# Altium schematic sheet MeteoStation_MCU.SchDoc: Модуль метеостанции
size 594 x 420 mm; DrawnBy: Подлесный; DocumentNumber: ФНКЦ.452312.001 Э3; SheetNumber: 1; SheetTotal: 2; Format: A2; DocumentType: Электрическая принципиальная; ImagePath: Введите номер платы
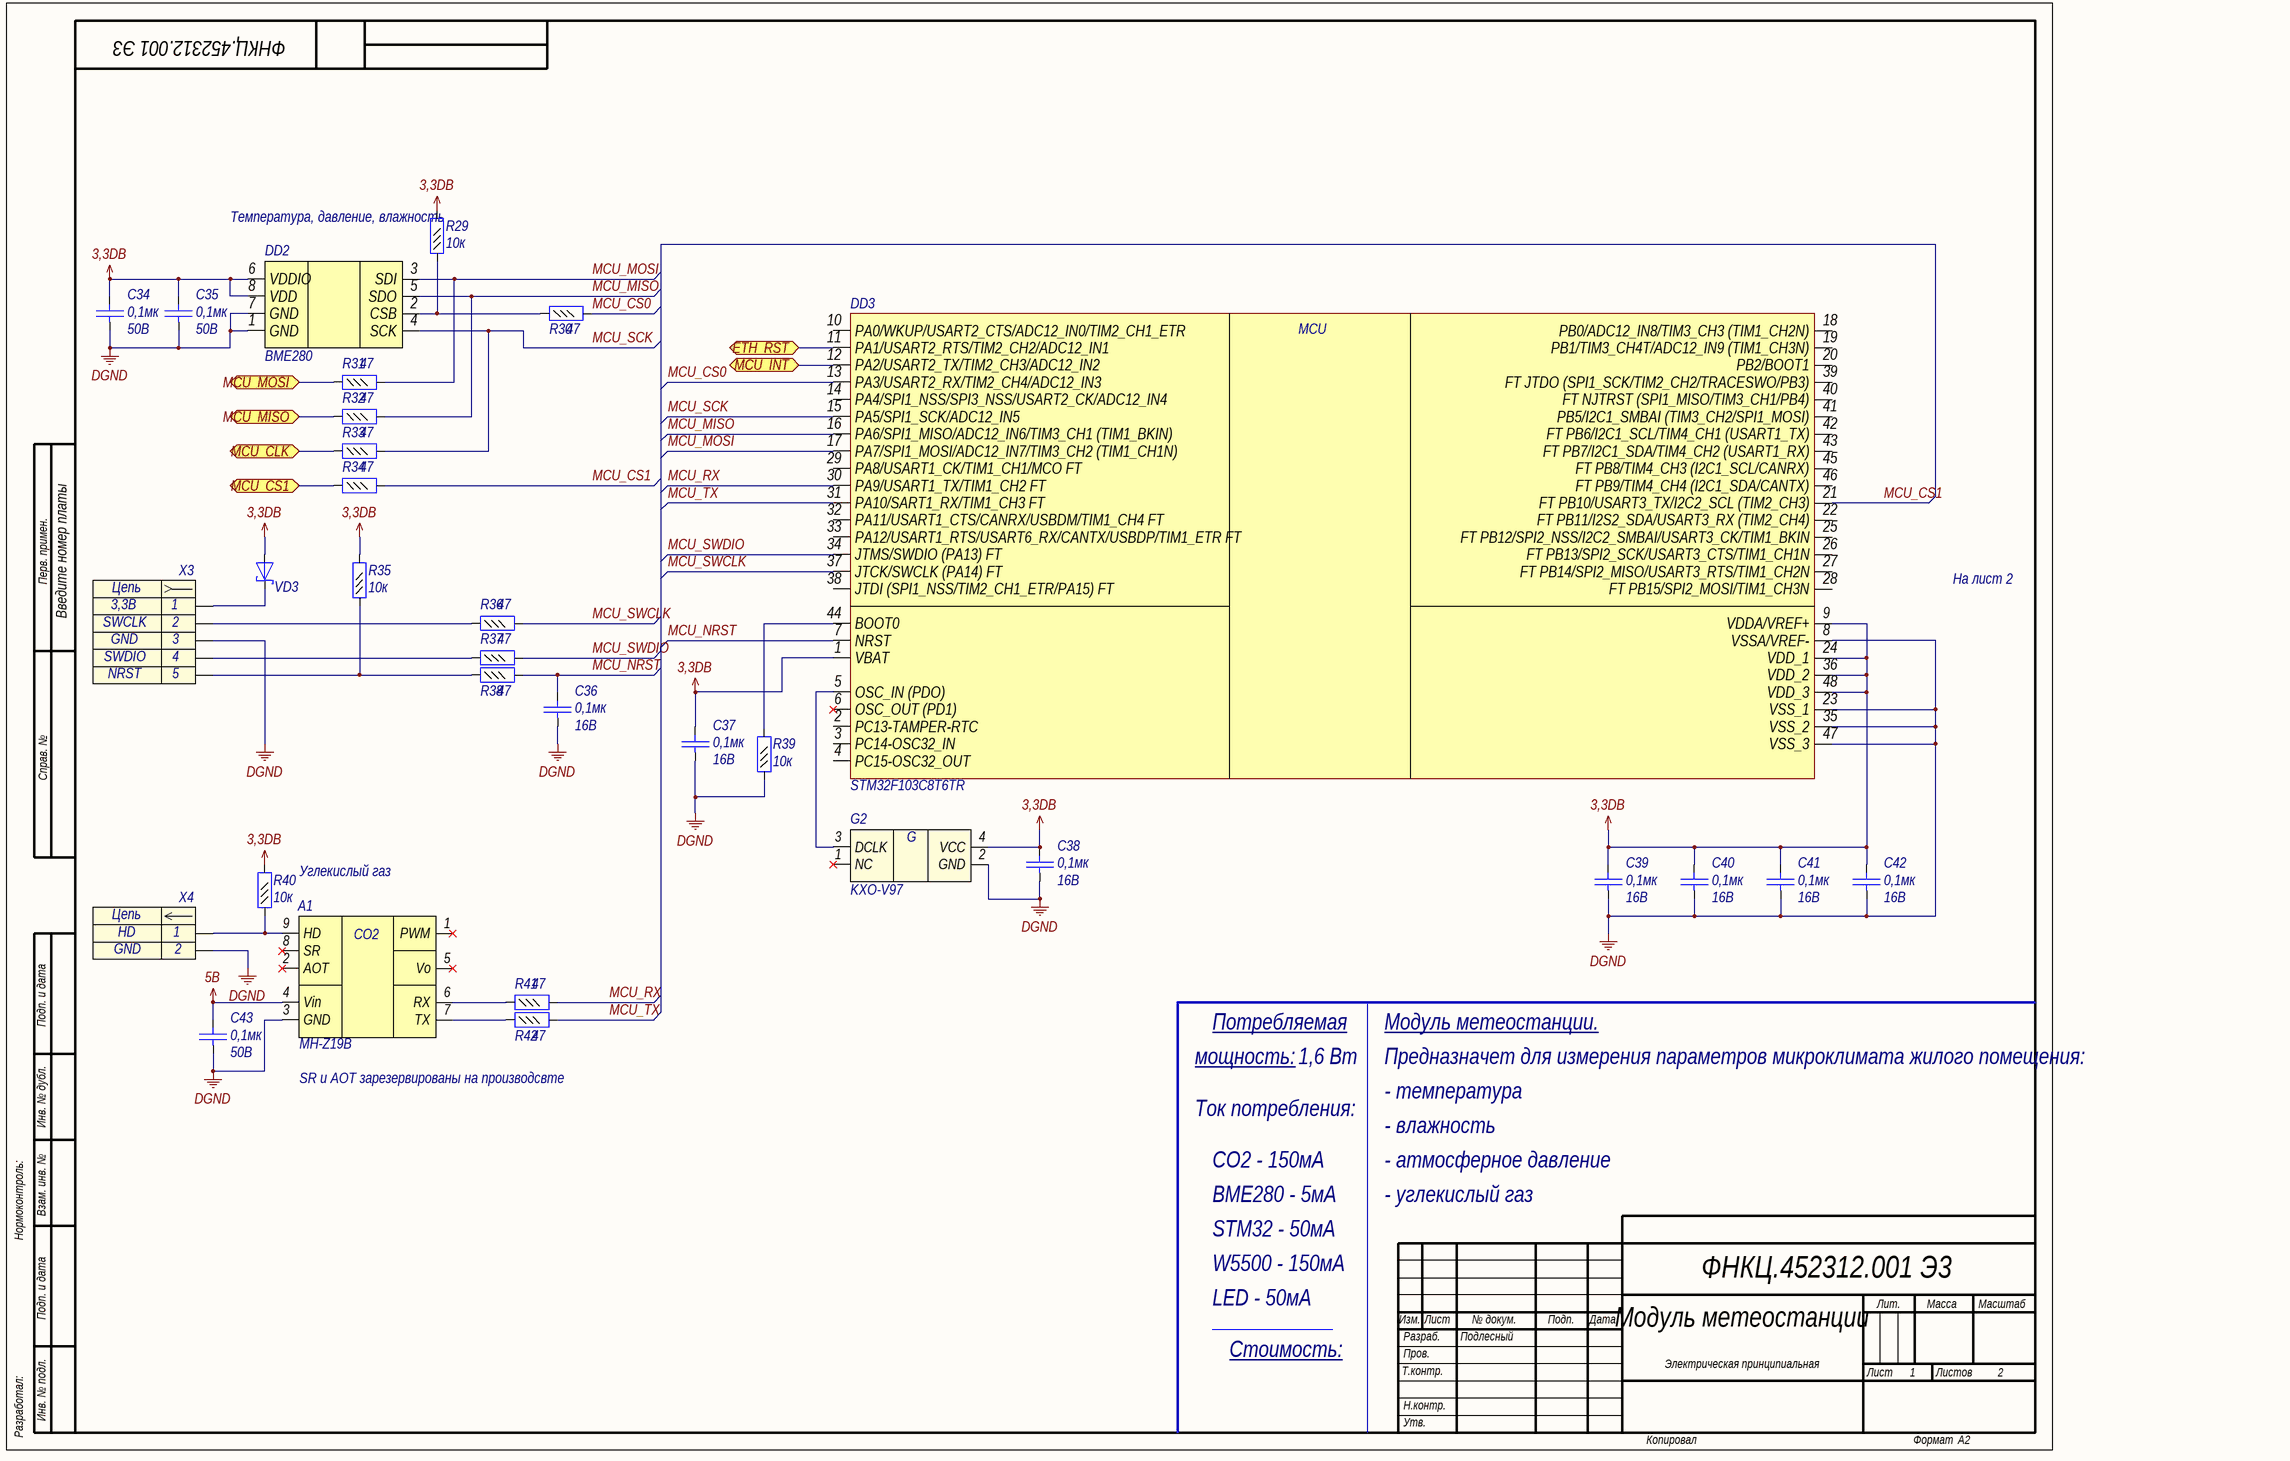
[diagram p0: MeteoStation_MCU.SchDoc]

## Parts
A1  MH-Z19B  [MH-Z19B]
C34  value 0,1мк  Voltage: 50B  [C0603]  (hidden comment: Capacitor)
C35  value 0,1мк  Voltage: 50B  [C0603]  (hidden comment: Capacitor)
C36  value 0,1мк  Voltage: 16B  [C0402]  (hidden comment: Capacitor)
C37  value 0,1мк  Voltage: 16B  [C0402]  (hidden comment: Capacitor)
C38  value 0,1мк  Voltage: 16B  [C0402]  (hidden comment: Capacitor)
C39  value 0,1мк  Voltage: 16B  [C0402]  (hidden comment: Capacitor)
C40  value 0,1мк  Voltage: 16B  [C0402]  (hidden comment: Capacitor)
C41  value 0,1мк  Voltage: 16B  [C0402]  (hidden comment: Capacitor)
C42  value 0,1мк  Voltage: 16B  [C0402]  (hidden comment: Capacitor)
C43  value 0,1мк  Voltage: 50B  [C0603]  (hidden comment: Capacitor)
DD2  BME280  [BME280]
DD3  STM32F103C8T6TR  [LQFP48]
G2  Part Number: KXO-V97  [QSMD7x5.2x1.8]  (hidden comment: KXO)
R29  value 10к  [R0402]  (hidden comment: Resistor_0,062Вт)
R30  value 47  [R0402]  (hidden comment: Resistor_0,062Вт)
R31  value 47  [R0402]  (hidden comment: Resistor_0,062Вт)
R32  value 47  [R0402]  (hidden comment: Resistor_0,062Вт)
R33  value 47  [R0402]  (hidden comment: Resistor_0,062Вт)
R34  value 47  [R0402]  (hidden comment: Resistor_0,062Вт)
R35  value 10к  [R0402]  (hidden comment: Resistor_0,062Вт)
R36  value 47  [R0402]  (hidden comment: Resistor_0,062Вт)
R37  value 47  [R0402]  (hidden comment: Resistor_0,062Вт)
R38  value 47  [R0402]  (hidden comment: Resistor_0,062Вт)
R39  value 10к  [R0402]  (hidden comment: Resistor_0,062Вт)
R40  value 10к  [R0402]  (hidden comment: Resistor_0,062Вт)
R41  value 47  [R0402]  (hidden comment: Resistor_0,062Вт)
R42  value 47  [R0402]  (hidden comment: Resistor_0,062Вт)
VD3  DiodeSchottky  [SOD-323]  (value not drawn)
X3  Header_5_sct  [53047-0510]  (value not drawn)
X4  (no value)  [JUMPER_2.54]

## Ports
ETH_RST, MCU_CLK, MCU_CS1, MCU_INT, MCU_MISO, MCU_MOSI

## Nets
3,3DB: C34.2 C35.2 C37.2 C38.2 C39.2 C40.2 C41.2 C42.2 DD2.6(VDDIO) DD2.8(VDD) DD3.1(VBAT) DD3.9(VDDA/VREF+) DD3.24(VDD_1) DD3.36(VDD_2) DD3.48(VDD_3) G2.4(VCC) R29.2 R35.2 R40.2 VD3.2(A)
5B: A1.4(Vin) C43.2
DGND: A1.3(GND) C34.1 C35.1 C36.1 C37.1 C38.1 C39.1 C40.1 C41.1 C42.1 C43.1 DD2.1(GND) DD2.7(GND) DD3.8(VSSA/VREF-) DD3.23(VSS_1) DD3.35(VSS_2) DD3.47(VSS_3) G2.2(GND) R39.1 X3.3 X4.2
ETH_RST: DD3.11(PA1/USART2_RTS/TIM2_CH2/ADC12_IN1) ; port ETH_RST
MCU_CLK: R33.1 ; port MCU_CLK
MCU_CS0: DD3.13(PA3/USART2_RX/TIM2_CH4/ADC12_IN3) R30.2
MCU_CS1: DD3.21(FT_PB10/USART3_TX/I2C2_SCL_(TIM2_CH3)) R34.2
MCU_CS1: R34.1 ; port MCU_CS1  [a separate net that carries the same name]
MCU_INT: DD3.12(PA2/USART2_TX/TIM2_CH3/ADC12_IN2) ; port MCU_INT
MCU_MISO: DD2.5(SDO) DD3.16(PA6/SPI1_MISO/ADC12_IN6/TIM3_CH1_(TIM1_BKIN)) R32.2
MCU_MISO: R32.1 ; port MCU_MISO  [a separate net that carries the same name]
MCU_MOSI: DD2.3(SDI) DD3.17(PA7/SPI1_MOSI/ADC12_IN7/TIM3_CH2_(TIM1_CH1N)) R31.2
MCU_MOSI: R31.1 ; port MCU_MOSI  [a separate net that carries the same name]
MCU_NRST: C36.2 DD3.7(NRST) R38.2
MCU_RX: DD3.30(PA9/USART1_TX/TIM1_CH2_FT) R41.2
MCU_SCK: DD2.4(SCK) DD3.15(PA5/SPI1_SCK/ADC12_IN5) R33.2
MCU_SWCLK: DD3.37(JTCK/SWCLK_(PA14)_FT) R36.2
MCU_SWDIO: DD3.34(JTMS/SWDIO_(PA13)_FT) R37.2
MCU_TX: DD3.31(PA10/SART1_RX/TIM1_CH3_FT) R42.2
NetA1_6: A1.6(RX) R41.1
NetA1_7: A1.7(TX) R42.1
NetA1_9: A1.9(HD) R40.1 X4.1
NetDD2_2: DD2.2(CSB) R29.1 R30.1
NetDD3_5: DD3.5(OSC_IN_(PDO)) G2.3(DCLK)
NetDD3_44: DD3.44(BOOT0) R39.2
NetR35_1: R35.1 R38.1 X3.5
NetR36_1: R36.1 X3.2
NetR37_1: R37.1 X3.4
NetVD3_1: VD3.1(K) X3.1

Not connected (* = marked no-connect by the designer): A1 1(PWM)* 2(AOT)* 5(Vo)* 8(SR)*; DD3 2(PC13-TAMPER-RTC) 3(PC14-OSC32_IN) 4(PC15-OSC32_OUT) 6(OSC_OUT_(PD1))* 10(PA0/WKUP/USART2_CTS/ADC12_IN0/TIM2_CH1_ETR) 14(PA4/SPI1_NSS/SPI3_NSS/USART2_CK/ADC12_IN4) 18(PB0/ADC12_IN8/TIM3_CH3_(TIM1_CH2N)) 19(PB1/TIM3_CH4T/ADC12_IN9_(TIM1_CH3N)) 20(PB2/BOOT1) 22(FT_PB11/I2S2_SDA/USART3_RX_(TIM2_CH4)) 25(FT_PB12/SPI2_NSS/I2C2_SMBAI/USART3_CK/TIM1_BKIN) 26(FT_PB13/SPI2_SCK/USART3_CTS/TIM1_CH1N) 27(FT_PB14/SPI2_MISO/USART3_RTS/TIM1_CH2N) 28(FT_PB15/SPI2_MOSI/TIM1_CH3N) 29(PA8/USART1_CK/TIM1_CH1/MCO_FT) 32(PA11/USART1_CTS/CANRX/USBDM/TIM1_CH4_FT) 33(PA12/USART1_RTS/USART6_RX/CANTX/USBDP/TIM1_ETR_FT) 38(JTDI_(SPI1_NSS/TIM2_CH1_ETR/PA15)_FT) 39(FT_JTDO_(SPI1_SCK/TIM2_CH2/TRACESWO/PB3)) 40(FT_NJTRST_(SPI1_MISO/TIM3_CH1/PB4)) 41(PB5/I2C1_SMBAI_(TIM3_CH2/SPI1_MOSI)) 42(FT_PB6/I2C1_SCL/TIM4_CH1_(USART1_TX)) 43(FT_PB7/I2C1_SDA/TIM4_CH2_(USART1_RX)) 45(FT_PB8/TIM4_CH3_(I2C1_SCL/CANRX)) 46(FT_PB9/TIM4_CH4_(I2C1_SDA/CANTX)); G2 1(NC)*

## Notes on the sheet
- (near R29) Температура, давление, влажность
- Перв. примен.
- На лист 2
- Справ. №
- Углекислый газ
- Подп. и дата
- мощность:
- Потребляемая
- 1,6 Вт
- Модуль метеостанции.
- Предназначет для измерения параметров микроклимата жилого помещения:
- Инв. № дубл.
- SR и AOT зарезервированы на производсвте
- - температура
- Ток потребления:
- - влажность
- Нормоконтроль:
- Взам. инв. №
- СО2 - 150мА
- BME280 - 5мА
- - атмосферное давление
- - углекислый газ
- STM32 - 50мА
- W5500 - 150мА
- LED - 50мА
- Изм.
- Лист
- № докум.
- Подп.
- Дата
- Лит.
- Масса
- Масштаб
- Стоимость:
- Т.контр.
- Пров.
- Разраб.
- Листов
- Разработал:
- Инв. № подл.
- Н.контр.
- Утв.
- Копировал
- Формат
- (in symbol connect54) Цепь
- (in symbol connect55) Цепь
- (in symbol crystal10) G
- (in symbol MH-Z19B) CO2
- (in symbol microcont0) MСU

## Library data of the parts
A1 = MH-Z19B: Part Name: Intelligent Infrared CO2 Module; Manufacture: Winsen; id: sensor3; Type sensor: СО2; Interface: PWM, UART; Part Number: MH-Z19B
C34 C35 C43 = cap131: Конденсатор; Part Name: Ceramic; Manufacture: Murata; Part Number: GRM188R71H104KA93D; id: cap131; TKE: X7R
C36-C42 = cap49: Конденсатор; Part Name: Ceramic; Manufacture: Murata; Part Number: GRM155R71C104KA88D; id: cap49; TKE: X7R
DD2 = BME280: Part Name: Digital Pressure Sensor; Manufacture: Bosch; id: sensor1; Type sensor: Humidity, Pressure, Temperature; Interface: I2C,SPI; Part Number: BME280
DD3 = microcont0: Medium-density performance line ARM®-based 32-bit MCU with 64  or 128 KB Flash, USB, CAN, 7 timers, 2 ADCs, 9 com. interfaces; Part Name: Microcontroller; Frequency: 72MHz; ADC: 10x12b; Interface: can, i2c, irda, lin, spi, uart, usb; Flash: 64kb; Pin in: 37; Power Supply: 2.0-3.6 V; id: microcont0; Part Number: STM32F103C8T6TR
G2 = crystal10: Кварц. генер. 32.768 МГц (HCMOS/TTL); Manufacture: GEYER; Frequence: 12MHz; id: crystal10
R29 R35 R39 R40 = res290: Резистор; Manufacture: Yageo; Part Number: RC0402FR-0710KL; id: res290; Accuracy: 0,01; Part Name: Resistor; Power: 0,062Вт
R30-R34 R36-R38 R41 R42 = res234: Резистор; Manufacture: Yageo; Part Number: RC0402FR-0747RL; id: res234; Accuracy: 0,01; Part Name: Resistor; Power: 0,062Вт
VD3 = diode19: Диод Шоттки; Part Number: PMEG4010BEA.115; Manufacture: NXP Semiconductor; Max Reverse Voltage: 40B; Forward Voltage: 0,64B; Forward Current: 10mA; Capacitance: 50pF; Number of Channels: 1; id: diode19; Part Name: Diode Schottky
X3 = connect55: Разъем - 5 конт. розетка; Part Name: 1.25mm Pitch PicoBlade; Manufacture: Molex; Contact_1: 3,3В; Contact_2: SWCLK; Contact_3: GND; Contact_4: SWDIO; Contact_5: NRST; Etch: 1,25mm; id: connect55; Part Number: 53047-0510
X4 = connect54: Разъем - 2 конт. вилка; Part Name: Jumper 2,54mm; Contact_1: HD; Contact_2: GND; Etch: 2,54mm; id: connect54